# Altium schematic sheet WIZ500SR-RP-EVB_RJ45.SchDoc
size A4; SheetNumber: 1; SheetTotal: 1
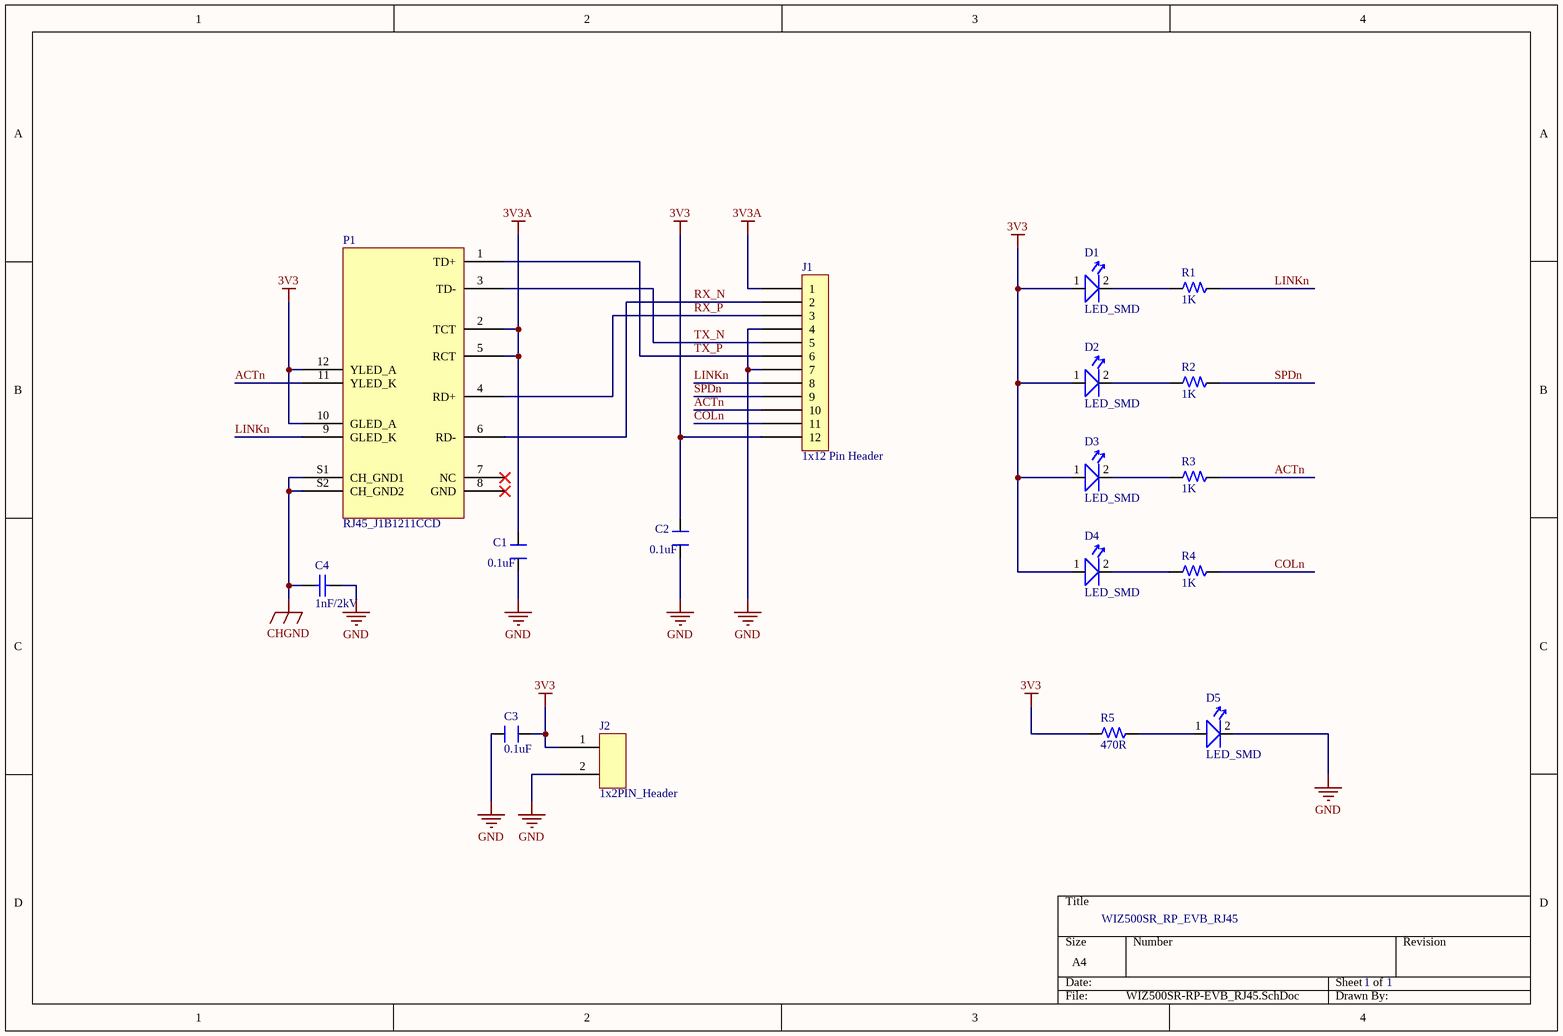
[diagram p0: WIZ500SR-RP-EVB_RJ45.SchDoc]

## Parts
C1  0.1uF  [CAP_0603]
C2  0.1uF  [CAP_0603]
C3  0.1uF  [CAP_0603]
C4  1nF/2kV  [CAPC4620X180X75LL50T35]
D1  LED_SMD  [LED-0603-RED]
D2  LED_SMD  [LED-0603-RED]
D3  LED_SMD  [LED-0603-RED]
D4  LED_SMD  [LED-0603-RED]
D5  LED_SMD  [LED-0603-RED]
J1  1x12 Pin Header  [12PIN_HEADER_2mm]
J2  1x2PIN_Header  [2PIN_HEADER]
P1  RJ45_J1B1211CCD  [RJ45-J1B1211CCD]
R1  1K  [RES-0603]
R2  1K  [RES-0603]
R3  1K  [RES-0603]
R4  1K  [RES-0603]
R5  470R  [RES-0603]

## Nets
3V3: C2.2 C3.1 D1.1 D2.1 D3.1 D4.1 J1.12 J2.1 P1.10(GLED_A) P1.12(YLED_A) R5.1
3V3A: C1.2 J1.1 P1.2(TCT) P1.5(RCT)
CHGND: C4.1 P1.S1(CH_GND1) P1.S2(CH_GND2)
GND: C1.1 C2.1 C3.2 C4.2 D5.2 J1.4 J1.7 J2.2
ACTn: J1.10 P1.11(YLED_K) R3.2
COLn: J1.11 R4.2
LINKn: J1.8 P1.9(GLED_K) R1.2
RX_N: J1.2 P1.6(RD-)
RX_P: J1.3 P1.4(RD+)
SPDn: J1.9 R2.2
TX_N: J1.5 P1.3(TD-)
TX_P: J1.6 P1.1(TD+)
NetD1_2: D1.2 R1.1
NetD2_2: D2.2 R2.1
NetD3_2: D3.2 R3.1
NetD4_2: D4.2 R4.1
NetD5_1: D5.1 R5.2

Not connected (* = marked no-connect by the designer): P1 7(NC)* 8(GND)*

## Notes on the sheet
- WIZ500SR_RP_EVB_RJ45
- 1

## Library data of the parts
C1-C3 = Cap
C4 = CMP-2000-05503-1: Chip Capacitor, 1000 pF, +/- 10%, 2000 V, -55 to 125 degC, 1808 (4520 Metric), RoHS, Tape and Reel; Manufacturer: AVX; Rated Voltage: 2000V; Dielectric: X7R; Capacitance: 1nF; Package Reference: 1808; Datasheet Version: 06/2016; Package Description: 2-Pin Surface Mount Device, Body 4.6 x 2 mm; Case Size/Dimension: 1808; Mounting Technology: SurfaceMount; Datasheet URL: http://datasheets.avx.com/AVX-HV_MLCC.pdf; Tolerance (%): ±10%; Manufacturer URL: http://www.avx.com/
J1 = 12PIN_2mm
J2 = 2PIN
R1-R5 = Res_(SMD)